# Altium project HPBIController.PrjPCB (part 3 of 8)

## Sheet DAC.SchDoc: 02290_Sonoma_Controller
size B; ApprovedBy: J Johnson; CheckedBy: J Johnson; Author: sdfasdfdfAEFfasdFfaF; DrawnBy: J Johnson; Organization: Opsero Electronic Design; Address1: 21-915 Av. Marguerite-Bourgeoys; Address2: Québec (QC); Address3: G1S 3X4; DocumentNumber: OP009-001-SCH; Revision: D-1; SheetNumber: 16; SheetTotal: 16; Tel1: (581) 308-8830; Tel2: (581) 308-8830; Project: 02290_Sonoma_Controller; CheckedDate: 2013-12-13; Sheet: DAC 10-bit 10-channel; PageSetup: Record=PageOptions|CenterHorizontal=True|CenterVertical=True|PrintScale=1.08|XCorrection=1.00|YCorrection=1.00|PrintKind=0|BorderSize=5000000|LeftOffset=0|BottomOffset=0|Orientation=2|PaperLength=1000|PaperWidth=1000|Scale=100|PaperSource=7|PrintQuality=-4|MediaType=1|DitherType=10|PaperKind=Tabloid     [11 x 17 in]|PrintScaleMode=1; DrawDate: 2013-12-13; SchTitle: 02290_Sonoma_Controller; RevDescription: Replaced Q2,Q3 with STD16NF06LT4; RevDate: 2020-07-07; RevBy: J Johnson; RevDescription2: Added resistors to QSPI interface; ModifiedDate: 2020-07-07
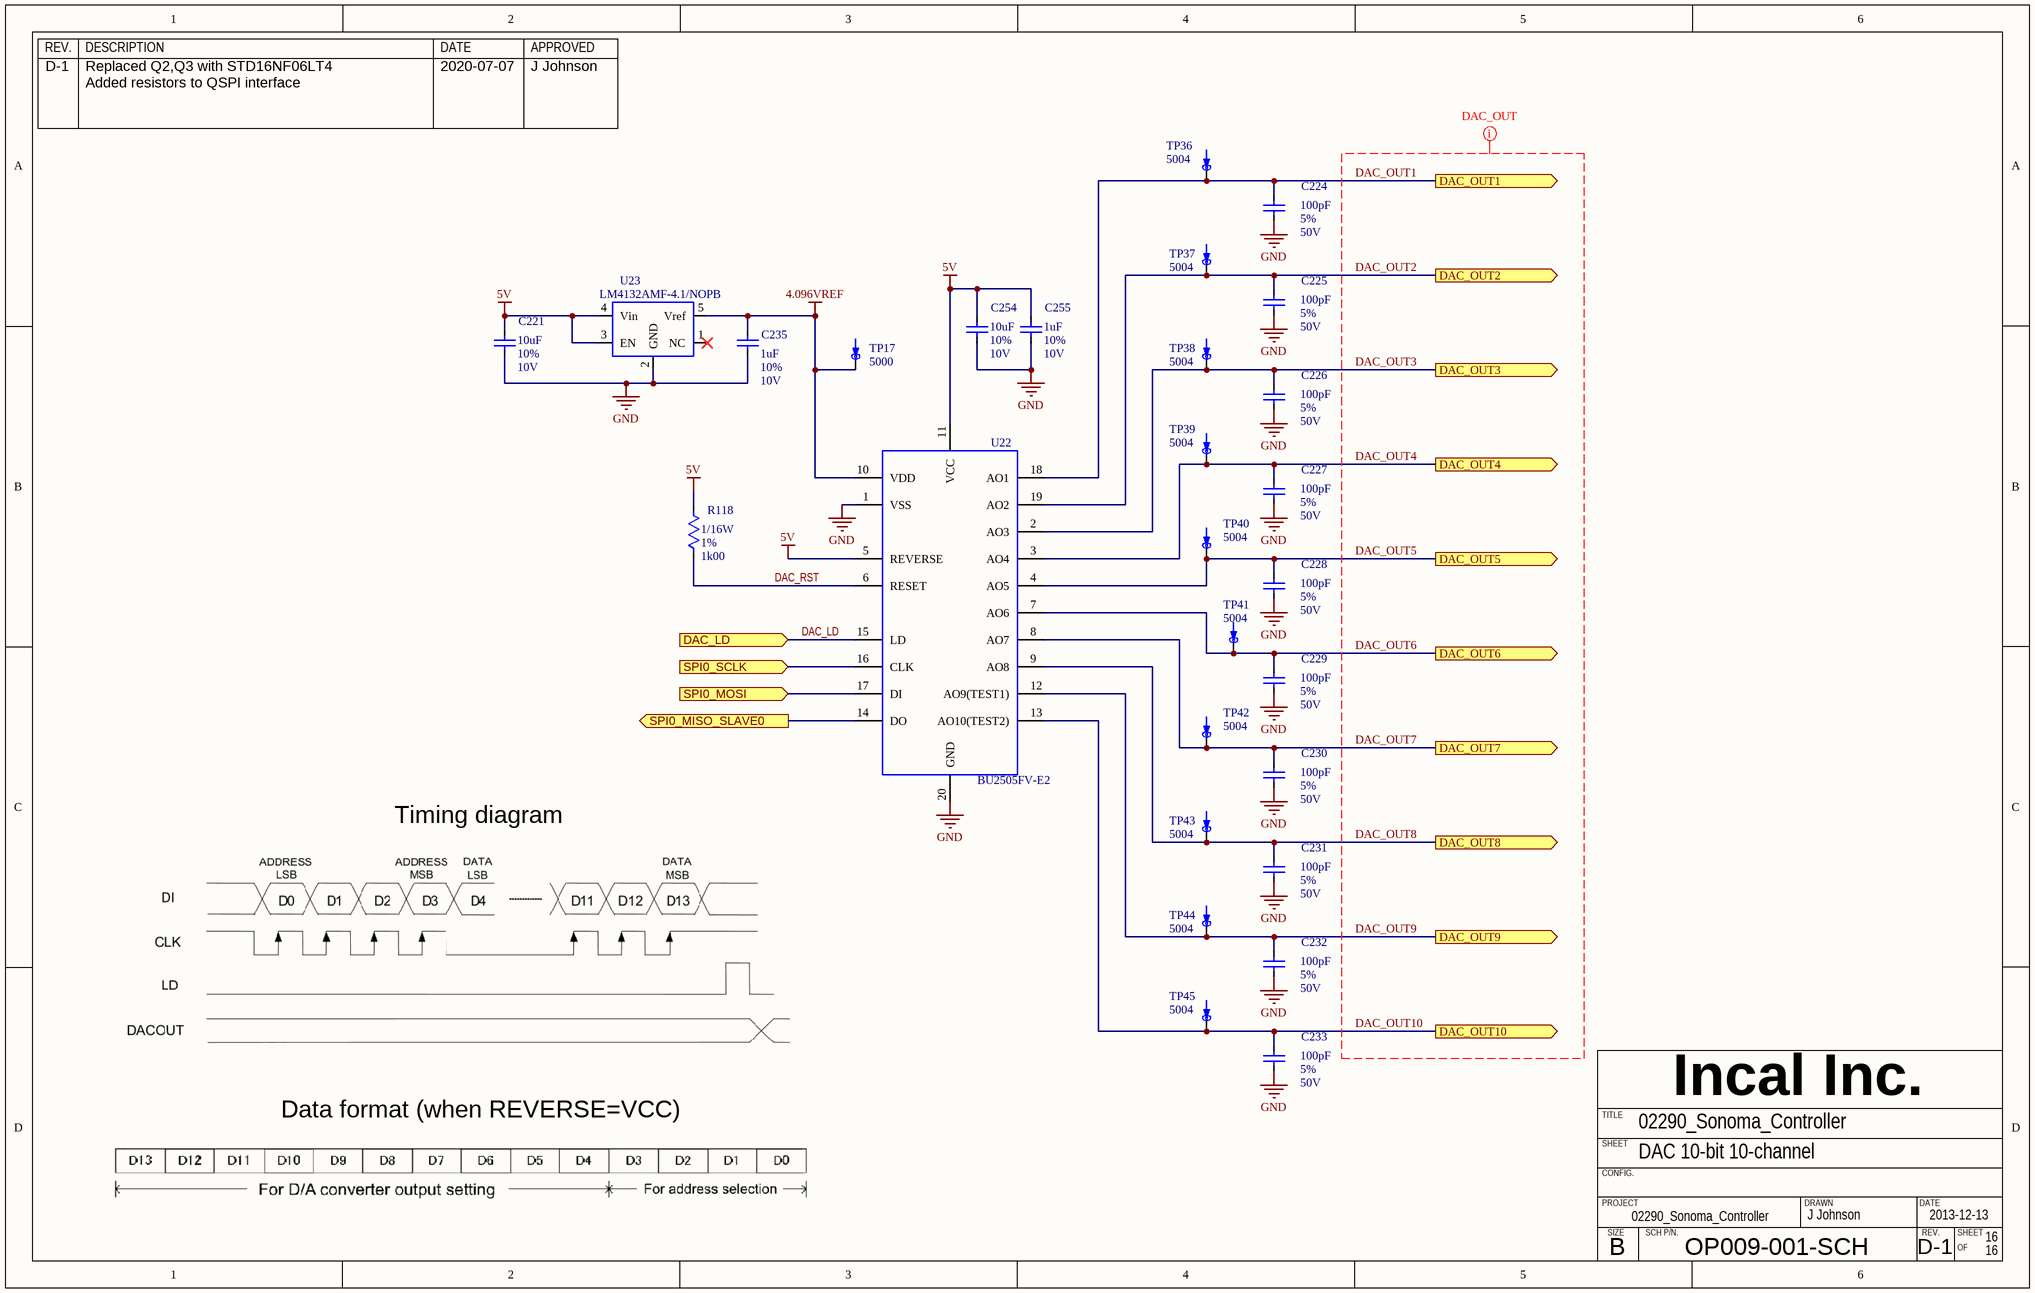
[diagram p4: DAC.SchDoc]

### Parts
C221  value 10uF  Tolerance: 10%  Voltage: 10V  [CAPC1608X38N]  (hidden comment: CAPACITOR_NP_TYPE1)
C224  value 100pF  Tolerance: 5%  Voltage: 50V  [CAPC1005X33N]  (hidden comment: CAPACITOR_NP_TYPE1)
C225  value 100pF  Tolerance: 5%  Voltage: 50V  [CAPC1005X33N]  (hidden comment: CAPACITOR_NP_TYPE1)
C226  value 100pF  Tolerance: 5%  Voltage: 50V  [CAPC1005X33N]  (hidden comment: CAPACITOR_NP_TYPE1)
C227  value 100pF  Tolerance: 5%  Voltage: 50V  [CAPC1005X33N]  (hidden comment: CAPACITOR_NP_TYPE1)
C228  value 100pF  Tolerance: 5%  Voltage: 50V  [CAPC1005X33N]  (hidden comment: CAPACITOR_NP_TYPE1)
C229  value 100pF  Tolerance: 5%  Voltage: 50V  [CAPC1005X33N]  (hidden comment: CAPACITOR_NP_TYPE1)
C230  value 100pF  Tolerance: 5%  Voltage: 50V  [CAPC1005X33N]  (hidden comment: CAPACITOR_NP_TYPE1)
C231  value 100pF  Tolerance: 5%  Voltage: 50V  [CAPC1005X33N]  (hidden comment: CAPACITOR_NP_TYPE1)
C232  value 100pF  Tolerance: 5%  Voltage: 50V  [CAPC1005X33N]  (hidden comment: CAPACITOR_NP_TYPE1)
C233  value 100pF  Tolerance: 5%  Voltage: 50V  [CAPC1005X33N]  (hidden comment: CAPACITOR_NP_TYPE1)
C235  value 1uF  Tolerance: 10%  Voltage: 10V  [CAPC1005X33N]  (hidden comment: CAPACITOR_NP_TYPE1)
C254  value 10uF  Tolerance: 10%  Voltage: 10V  [CAPC1608X38N]  (hidden comment: CAPACITOR_NP_TYPE1)
C255  value 1uF  Tolerance: 10%  Voltage: 10V  [CAPC1005X33N]  (hidden comment: CAPACITOR_NP_TYPE1)
R118  value 1k00  Power: 1/16W  Tolerance: 1%  [RESC1005X33N]  (hidden comment: *)
TP17  value 5000  [KEY_5000]  (hidden comment: TEST_POINT_TYPE4)
TP36  value 5004  [KEY_5004]  (hidden comment: TEST_POINT_TYPE4)
TP37  value 5004  [KEY_5004]  (hidden comment: TEST_POINT_TYPE4)
TP38  value 5004  [KEY_5004]  (hidden comment: TEST_POINT_TYPE4)
TP39  value 5004  [KEY_5004]  (hidden comment: TEST_POINT_TYPE4)
TP40  value 5004  [KEY_5004]  (hidden comment: TEST_POINT_TYPE4)
TP41  value 5004  [KEY_5004]  (hidden comment: TEST_POINT_TYPE4)
TP42  value 5004  [KEY_5004]  (hidden comment: TEST_POINT_TYPE4)
TP43  value 5004  [KEY_5004]  (hidden comment: TEST_POINT_TYPE4)
TP44  value 5004  [KEY_5004]  (hidden comment: TEST_POINT_TYPE4)
TP45  value 5004  [KEY_5004]  (hidden comment: TEST_POINT_TYPE4)
U22  BU2505FV-E2  [SSOP65P440X650X115-20N]
U23  Mfg Part Number 1: LM4132AMF-4.1/NOPB  [SOT65P280X145-5AN]  (hidden comment: LM4132)

### Ports
DAC_LD (in), DAC_OUT1 (out), DAC_OUT2 (out), DAC_OUT3 (out), DAC_OUT4 (out), DAC_OUT5 (out), DAC_OUT6 (out), DAC_OUT7 (out), DAC_OUT8 (out), DAC_OUT9 (out), DAC_OUT10 (out), SPI0_MISO_SLAVE0 (out), SPI0_MOSI (in), SPI0_SCLK (in)

### Nets
4.096VREF: C235.1 TP17.1 U22.10(VDD) U23.5(Vref)
5V: C221.1 C254.1 C255.1 R118.2 U22.5(REVERSE) U22.11(VCC) U23.3(EN) U23.4(Vin)
GND: C221.2 C224.2 C225.2 C226.2 C227.2 C228.2 C229.2 C230.2 C231.2 C232.2 C233.2 C235.2 C254.2 C255.2 U22.1(VSS) U22.20(GND) U23.2(GND)
DAC_LD: U22.15(LD) ; port DAC_LD
DAC_OUT1: C224.1 TP36.1 U22.18(AO1) ; port DAC_OUT1
DAC_OUT2: C225.1 TP37.1 U22.19(AO2) ; port DAC_OUT2
DAC_OUT3: C226.1 TP38.1 U22.2(AO3) ; port DAC_OUT3
DAC_OUT4: C227.1 TP39.1 U22.3(AO4) ; port DAC_OUT4
DAC_OUT5: C228.1 TP40.1 U22.4(AO5) ; port DAC_OUT5
DAC_OUT6: C229.1 TP41.1 U22.7(AO6) ; port DAC_OUT6
DAC_OUT7: C230.1 TP42.1 U22.8(AO7) ; port DAC_OUT7
DAC_OUT8: C231.1 TP43.1 U22.9(AO8) ; port DAC_OUT8
DAC_OUT9: C232.1 TP44.1 U22.12(AO9(TEST1)) ; port DAC_OUT9
DAC_OUT10: C233.1 TP45.1 U22.13(AO10(TEST2)) ; port DAC_OUT10
DAC_RST: R118.1 U22.6(RESET)
SPI0_MISO_SLAVE0: U22.14(DO) ; port SPI0_MISO_SLAVE0
SPI0_MOSI: U22.17(DI) ; port SPI0_MOSI
SPI0_SCLK: U22.16(CLK) ; port SPI0_SCLK

Not connected (* = marked no-connect by the designer): U23 1(NC)*

### Layout directives
net class DAC_OUT(1_10): DAC_OUT1, DAC_OUT2, DAC_OUT3, DAC_OUT4, DAC_OUT5, DAC_OUT6, DAC_OUT7, DAC_OUT8, DAC_OUT9, DAC_OUT10

### Notes on the sheet
- Timing diagram
- Data format (when REVERSE=VCC)
- REV.
- DESCRIPTION
- DATE
- APPROVED
- Incal Inc.
- SHEET
- TITLE
- CONFIG.
- PROJECT
- SIZE
- SCH P/N.
- DRAWN
- B
- OF

### Library data of the parts
C221 C254 = C0603_10uF_10%_10V_X5R: as C215 on sheet ADC; Status: Active; Power: *; Current: *; Part Ref: C0603_10uF_10%_10V_X5R; Comment_1: *; RoHs: True; Operating Temp: -55 to +85 C
C224-C233 = C0402_100pF_5%_50V_C0G: Capacitor ceramic, C0G (NP0), 100pF, 50V, 5%, -55 to +125 C, EIA0402; Manufacturer 1: Murata; Mfg Part Number 1: GRM1555C1H101JA01D; EIA(I) Package: 0402; EIA(M) Package: 1005; ASSY: USED; Status: Active; Power: *; Current: *; Part Ref: C0402_100pF_5%_50V_C0G; Comment_1: *; RoHs: True; Operating Temp: -55 to +125 C; Datasheet 1: ..\datasheet\Capacitor\Murata\GRM_Serie\Series catalog\2013-04-30
C235 C255 = C0402_1uF_10%_10V_X5R: Capacitor ceramic, X5R, 1uF, 10V, 10%, -55 to +85 C, EIA0402; Manufacturer 1: Murata; Mfg Part Number 1: GRM155R61A105KE15J; EIA(I) Package: 0402; EIA(M) Package: 1005; ASSY: USED; Status: Active; Power: *; Current: *; Part Ref: C0402_1uF_10%_10V_X5R; Comment_1: *; RoHs: True; Operating Temp: -55 to +85 C
R118 = R0402_1k00_1%: as R99 on sheet ADC; Status: Active; Part Ref: R0402_1k00_1%; Current: *; Comment_1: *; RoHs: True; Operating Temp: -55 to +155 C; Datasheet 1: ..\datasheet\Resistor\Yaego\Thick_Film\RC0402\2012-03-29; Manufacturer 2: Vishay Dale; Mfg Part Number 2: CRCW04021k00FKED; Datasheet 2: ..\datasheet\Resistor\Vishay Dale\CRC\2012-03-29
TP17 = 5000: as TP29 on sheet ADC; Status: Active; EIA(I) Package: *; EIA(M) Package: *; Part Ref: 5000; Tolerance: *; Package: *; RoHs: True; Mfg Part Number 1: 5000; Datasheet 1: ..\datasheet\Connector\Keystone Electronics\5001-5014\2012-06-28
TP36-TP45 = 5004: as TP18 on sheet ADC; Status: Active; EIA(I) Package: *; EIA(M) Package: *; Part Ref: 5004; Tolerance: *; Package: *; RoHs: True; Mfg Part Number 1: 5004; Datasheet 1: ..\datasheet\Connector\Keystone Electronics\5001-5014\2012-06-28
U22 = BU2505FV-E2: DAC 10 bit, High precision, 10 channel, 4.5 to 5.5V, -30 to +85C; Manufacturer 1: Rohm; PART NUMBER: BU2505FV-E2; Part Ref: BU2505FV-E2; Status: Active; RoHs: True; Value: BU2505FV-E2; Mfg Part Number 1: BU2505FV-E2; Package: SSOP-20
U23 = LM4132AMF-4.1/NOPB: Reference 4.096V low dropout, 20mA, 10ppm, 0.05%; Manufacturer 1: TI; ASSY: USED; Power: Pow; Voltage: 5.5V; Value: 3.3; Status: Active; EIA(I) Package: *; EIA(M) Package: *; Part Ref: LM4132AMF-4.1/NOPB; Current: 20mA; Tolerance: ±0.05%; Package: SOT23-5; RoHs: True; Operating Temp: -40 to +125 C; Datasheet 1: ..\datasheet\Reference\lm4132\2012-12-04\